# EAGLE design ds8 (EAGLE 6.1)
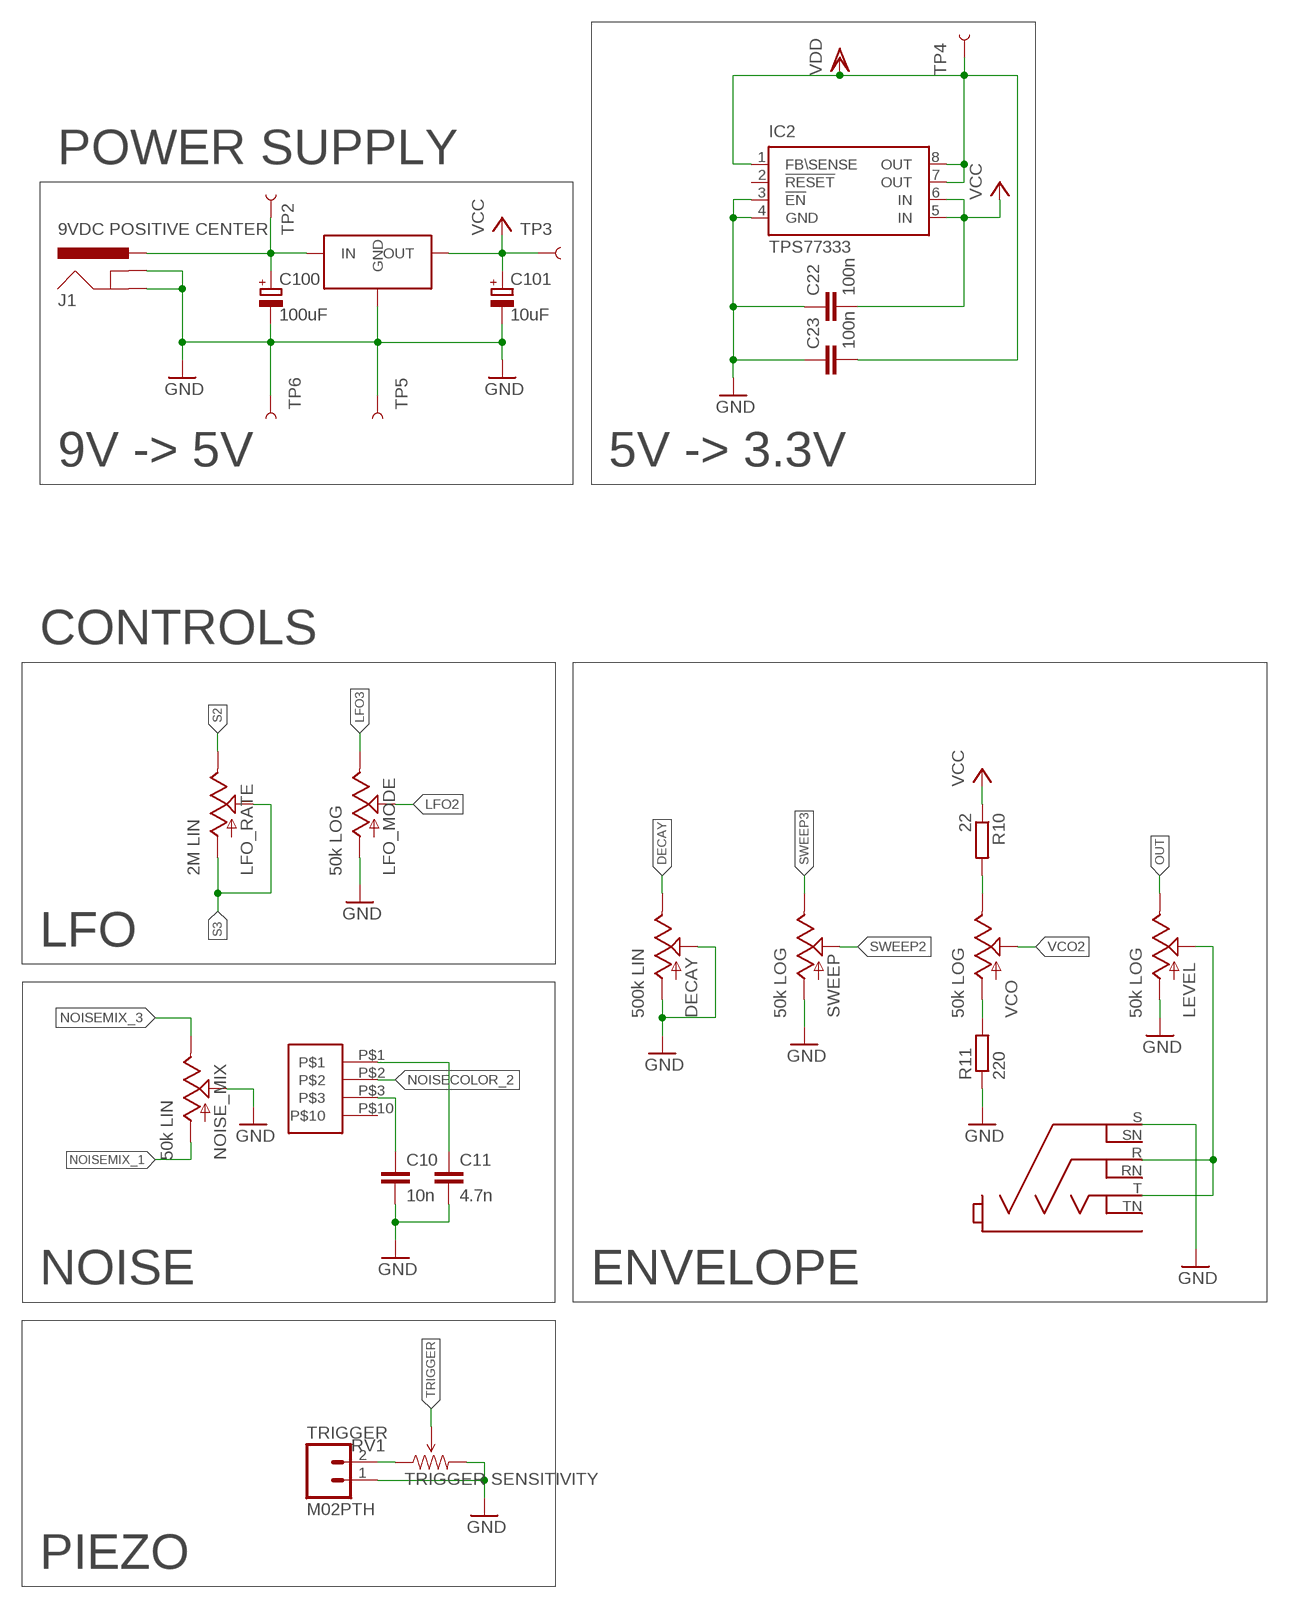
[diagram p0: schematic, sheet 1, part 1 of 2]
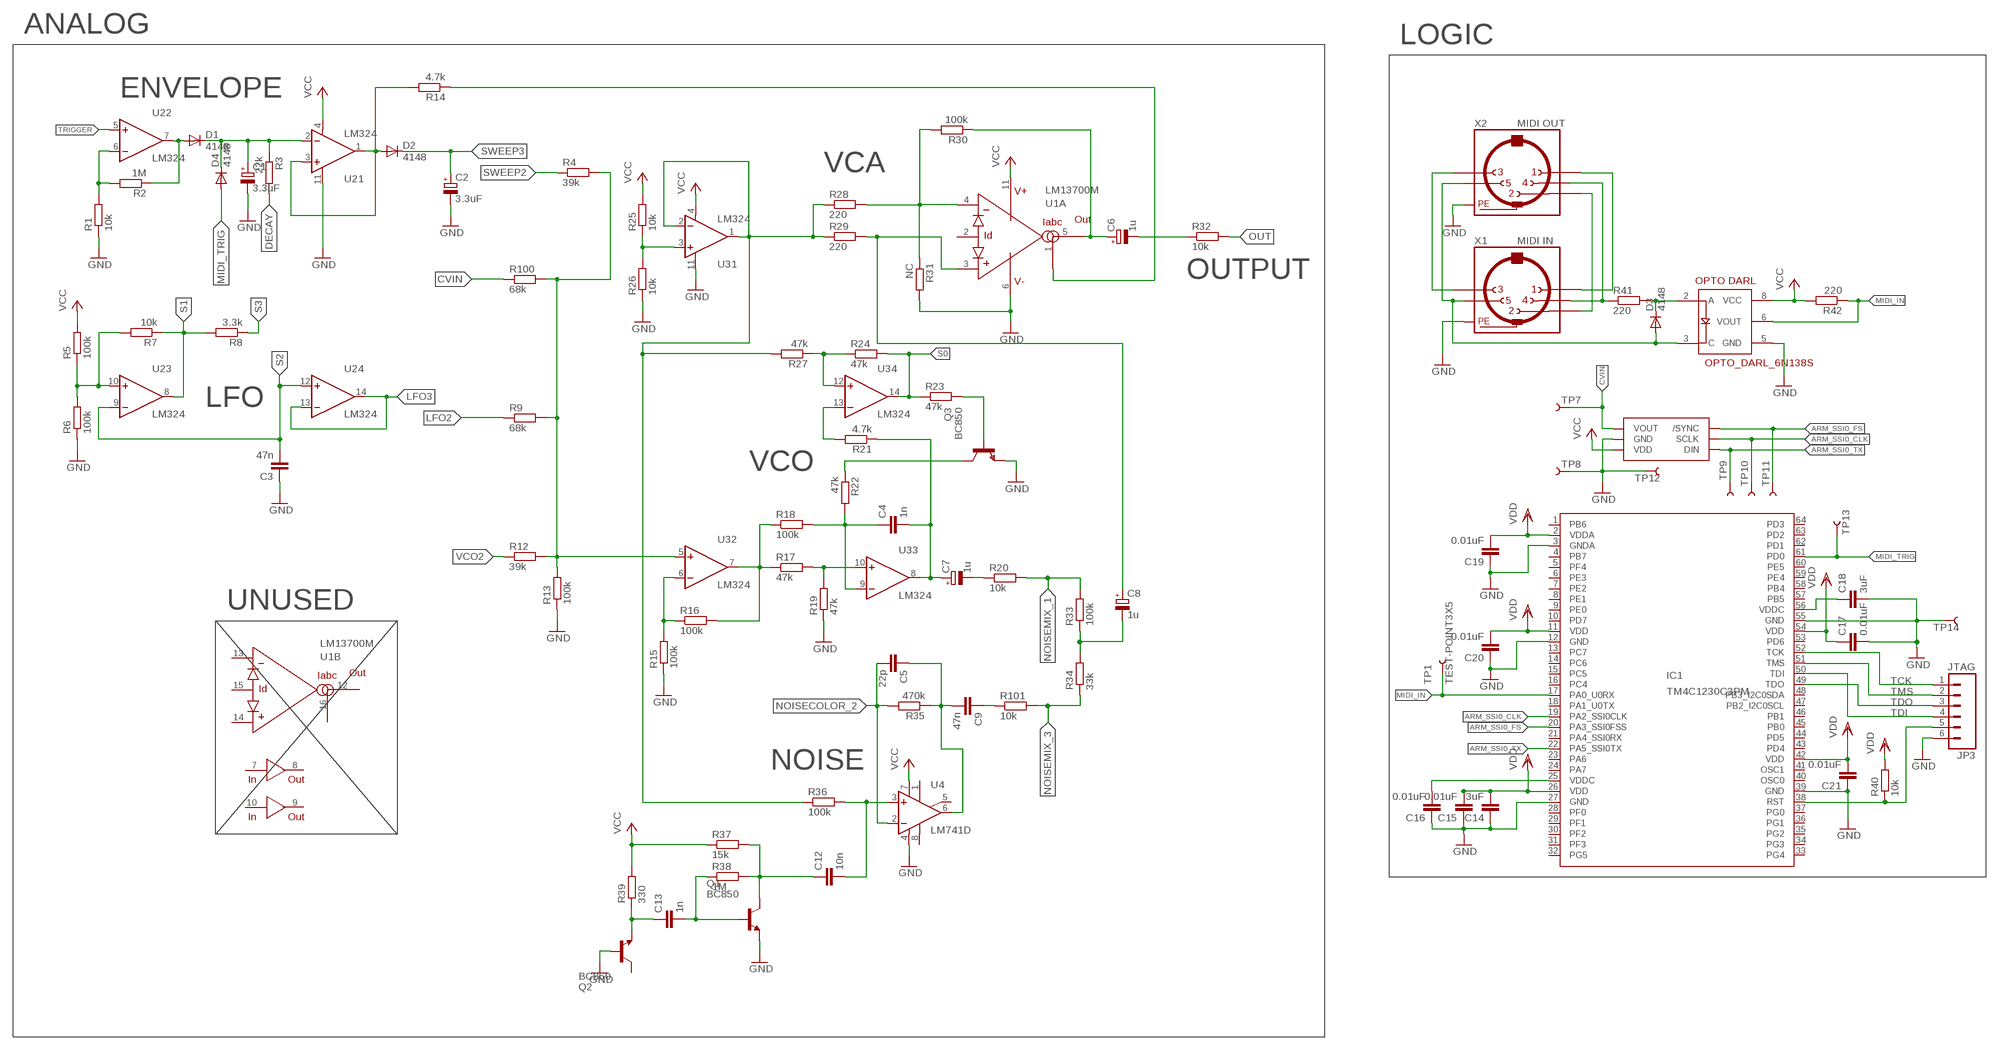
[diagram p1: schematic, sheet 1, part 2 of 2]

## Parts
C1  3.3uF  CPOL-EUR/2012-12R  [R/2012-12R]
C2  3.3uF  CPOL-EUR/2012-12R  [R/2012-12R]
C3  47n  C-EUC1206  [C1206]
C4  1n  C-EUC1206  [C1206]
C5  22p  C-EUC1206  [C1206]
C6  1u  CPOL-EUR/2012-12R  [R/2012-12R]
C7  1u  CPOL-EUR/2012-12R  [R/2012-12R]
C8  1u  CPOL-EUR/2012-12R  [R/2012-12R]
C9  47n  C-EUC1206  [C1206]
C10  10n  C-EUC1206  [C1206]
C11  4.7n  C-EUC1206  [C1206]
C12  10n  C-EUC1206  [C1206]
C13  1n  C-EUC1206  [C1206]
C14  3uF  C-EUC1206  [C1206]
C15  0.01uF  C-EUC1206  [C1206]
C16  0.01uF  C-EUC1206  [C1206]
C17  0.01uF  C-EUC1206  [C1206]
C18  3uF  C-EUC1206  [C1206]
C19  0.01uF  C-EUC1206  [C1206]
C20  0.01uF  C-EUC1206  [C1206]
C21  0.01uF  C-EUC1206  [C1206]
C22  100n  C-EUC1206  [C1206]
C23  100n  C-EUC1206  [C1206]
C100  100uF  CPOL-EUD  [PANASONIC_D]
C101  10uF  CPOL-EUR/2012-12R  [R/2012-12R]
D1  4148  DIODE-MINIMELF  [MINIMELF]
D2  4148  DIODE-MINIMELF  [MINIMELF]
D3  4148  DIODE-MINIMELF  [MINIMELF]
D4  4148  DIODE-MINIMELF  [MINIMELF]
DECAY  500k LIN  POTALPS-KIT  [ALPS_POT_KIT]
IC1  TM4C1230C3PM  [LQFP_64]
IC2  TPS77333  [SOP-08]
IC3  DAC7512  [SOT-23-6]
J1  9VDC POSITIVE CENTER  POWER_JACKPTH_LOCK  [POWER_JACK_PTH_LOCK]
JP3  JTAG  M06SIP  [1X06]
LEVEL  50k LOG  POTALPS-KIT  [ALPS_POT_KIT]
LFO_MODE  50k LOG  POTALPS-KIT  [ALPS_POT_KIT]
LFO_RATE  2M LIN  POTALPS-KIT  [ALPS_POT_KIT]
NOISE_MIX  50k LIN  POTALPS-KIT  [ALPS_POT_KIT]
Q1  BC850  [SOT23]
Q2  BC850  [SOT23]
Q3  BC850  [SOT23]
R1  10k  R-EU_R0805  [R0805]
R2  1M  R-EU_R0805  [R0805]
R3  22k  R-EU_R0805  [R0805]
R4  39k  R-EU_R0805  [R0805]
R5  100k  R-EU_R0805  [R0805]
R6  100k  R-EU_R0805  [R0805]
R7  10k  R-EU_R0805  [R0805]
R8  3.3k  R-EU_R0805  [R0805]
R9  68k  R-EU_R0805  [R0805]
R10  22  R-EU_R0805  [R0805]
R11  220  R-EU_R0805  [R0805]
R12  39k  R-EU_R0805  [R0805]
R13  100k  R-EU_R0805  [R0805]
R14  4.7k  R-EU_R0805  [R0805]
R15  100k  R-EU_R0805  [R0805]
R16  100k  R-EU_M0805  [M0805]
R17  47k  R-EU_M0805  [M0805]
R18  100k  R-EU_M0805  [M0805]
R19  47k  R-EU_M0805  [M0805]
R20  10k  R-EU_M0805  [M0805]
R21  4.7k  R-EU_M0805  [M0805]
R22  47k  R-EU_M0805  [M0805]
R23  47k  R-EU_M0805  [M0805]
R24  47k  R-EU_M0805  [M0805]
R25  10k  R-EU_M0805  [M0805]
R26  10k  R-EU_M0805  [M0805]
R27  47k  R-EU_M0805  [M0805]
R28  220  R-EU_M0805  [M0805]
R29  220  R-EU_M0805  [M0805]
R30  100k  R-EU_M0805  [M0805]
R31  NC  R-EU_M0805  [M0805]
R32  10k  R-EU_M0805  [M0805]
R33  100k  R-EU_M0805  [M0805]
R34  33k  R-EU_M0805  [M0805]
R35  470k  R-EU_M0805  [M0805]
R36  100k  R-EU_M0805  [M0805]
R37  15k  R-EU_M0805  [M0805]
R38  1M  R-EU_M0805  [M0805]
R39  330  R-EU_M0805  [M0805]
R40  10k  R-EU_M0805  [M0805]
R41  220  R-EU_R0805  [R0805]
R42  220  R-EU_R0805  [R0805]
R100  68k  R-EU_R0805  [R0805]
R101  10k  R-EU_M0805  [M0805]
RV1  TRIGGER SENSITIVITY  TRIMPOT  [TRIMPOT-5MM-V2]
SWEEP  50k LOG  POTALPS-KIT  [ALPS_POT_KIT]
TP1  TEST-POINT3X5  [PAD.03X.05]
TP2  TEST-POINT3X5  [PAD.03X.05]
TP3  TEST-POINT3X5  [PAD.03X.05]
TP4  TEST-POINT3X5  [PAD.03X.05]
TP5  TEST-POINT3X5  [PAD.03X.05]
TP6  TEST-POINT3X5  [PAD.03X.05]
TP7  TEST-POINT3X5  [PAD.03X.05]
TP8  TEST-POINT3X5  [PAD.03X.05]
TP9  TEST-POINT3X5  [PAD.03X.05]
TP10  TEST-POINT3X5  [PAD.03X.05]
TP11  TEST-POINT3X5  [PAD.03X.05]
TP12  TEST-POINT3X5  [PAD.03X.05]
TP13  TEST-POINT3X5  [PAD.03X.05]
TP14  TEST-POINT3X5  [PAD.03X.05]
TRIGGER  M02PTH  [1X02]
U1  LM13700M  DS8_LM13700M  [DS8_SO16]
U2  LM324  [SOIC-14]
U3  LM324  [SOIC-14]
U4  LM741D  [SO08]
U100  VREG-7805-DPAK2  [VREG-7805-DPAK2]
U$1  6.35MMJACK  [NMJ6HCD3]
U$3  ALPS_SRBV  [ALPS_SRBV]
U$4  OPTO_DARL_6N138S  [8-SMD]
VCO  50k LOG  POTALPS-KIT  [ALPS_POT_KIT]
X1  MIDI IN  MAB5SH  [MAB5SH]
X2  MIDI OUT  MAB5SH  [MAB5SH]

## Nets
9VDC: C100.+ J1.PWR TP2.P$1 U100.VIN(IN)
ARM_SSI0_CLK: IC1.19(PA2_SSI0CLK) IC3.5(SCLK) TP10.P$1
ARM_SSI0_FS: IC1.20(PA3_SSI0FSS) IC3.6(/SYNC) TP11.P$1
ARM_SSI0_TX: IC1.22(PA5_SSI0TX) IC3.4(DIN) TP9.P$1
CVIN: IC3.1(VOUT) R100.1 TP7.P$1
DECAY: DECAY.P$1(E) R3.2
GND: C1.- C2.- C3.1 C10.2 C11.2 C14.1 C15.1 C16.1 C17.2 C18.2 C19.1 C20.1 C21.1 C22.1 C23.1 C100.- C101.- DECAY.P$2(S) DECAY.P$3(A) IC1.3(GNDA) IC1.12(GND) IC1.27(GND) IC1.39(GND) IC1.55(GND) IC2.3(!EN) IC2.4(GND) IC3.2(GND) J1.GND J1.GNDBREAK JP3.6 LEVEL.P$3(A) LFO_MODE.P$3(A) NOISE_MIX.P$2(S) Q1.2(E) Q2.1(B) Q3.2(E) R1.1 R6.1 R11.1 R13.1 R15.1 R19.1 R26.1 R31.2 RV1.C(CW) SWEEP.P$3(A) TP5.P$1 TP6.P$1 TP8.P$1 TP12.P$1 TP14.P$1 TRIGGER.1 U1.6(V-) U2.11(1:V-) U3.11(1:V-) U4.4(V-) U100.GND U$1.S U$4.5(GND) X1.PE X1.PE@(PE) X2.PE X2.PE@(PE)
LFO2: LFO_MODE.P$2(S) R9.1
LFO3: LFO_MODE.P$1(E) U2.13(4:-IN) U2.14(4:OUT)
MIDI_IN: IC1.17(PA0_U0RX) R42.1 TP1.P$1 U$4.6(VOUT)
MIDI_TRIG: D4.A IC1.61(PD0) TP13.P$1
N$1: D1.A R2.1 U2.7(2:OUT)
N$2: R1.2 R2.2 U2.6(2:-IN)
N$3: C1.+ D1.C D4.C R3.1 U2.2(1:-IN)
N$4: D2.A R14.2 U2.1(1:OUT) U2.3(1:+IN)
N$5: R5.1 R6.2 R7.2 U2.10(3:+IN)
N$6: X1.1 X2.1
N$7: R15.2 R16.1 U3.6(2:-IN)
N$8: R4.2 R9.2 R12.2 R13.2 R100.2 U3.5(2:+IN)
N$9: R16.2 R17.1 R18.1 U3.7(2:OUT)
N$10: R17.2 R19.2 U3.10(3:+IN)
N$11: C4.1 R18.2 R22.2 U3.9(3:-IN)
N$12: C8.- R33.1 R34.2
N$13: C7.- R20.1
N$14: C4.2 C7.+ R21.1 U3.8(3:OUT)
N$15: Q3.3(C) R22.1
N$16: R21.2 U3.13(4:-IN)
N$17: R24.1 R27.1 U3.12(4:+IN)
N$18: R41.1 X1.4 X2.4
N$19: Q3.1(B) R23.2
N$20: R27.2 R28.1 R29.1 R36.1 U3.1(1:OUT) U3.2(1:-IN)
N$21: C9.1 R101.1
N$22: R25.1 R26.2 U3.3(1:+IN)
N$23: R28.2 R30.2 R31.1 U1.4(A:-IN)
N$24: C8.+ R29.2 U1.3(A:+IN)
N$25: C6.- R32.1
N$26: D3.C R41.2 U$4.2(A)
N$27: C6.+ R30.1 U1.5(A:OUT)
N$28: C5.1 C9.2 R35.1 U4.6(OUT)
N$29: C12.1 Q1.3(C) R37.2 R38.2
N$30: C12.2 R36.2 U4.3(+IN)
N$31: R14.1 U1.1(A:IABC)
N$32: C13.2 Q1.1(B) R38.1
N$33: C13.1 Q2.2(E) R39.1
N$34: RV1.A(CCW) TRIGGER.2
N$35: D3.A U$4.3(C) X1.5 X2.5
N$36: C18.1 IC1.56(VDDC)
N$37: R10.2 VCO.P$1(E)
N$38: R11.2 VCO.P$3(A)
N$39: C10.1 U$3.P$3
N$40: C11.1 U$3.P$1
N$41: X1.2 X2.2
N$42: C16.2 IC1.25(VDDC)
N$43: X1.3 X2.3
N$57: LEVEL.P$2(S) U$1.R U$1.T
NOISECOLOR_2: C5.2 R35.2 U4.2(-IN) U$3.P$2
NOISEMIX_1: NOISE_MIX.P$3(A) R20.2 R33.2
NOISEMIX_3: NOISE_MIX.P$1(E) R34.1 R101.2
OUT: LEVEL.P$1(E) R32.2
RST: IC1.38(RST) JP3.5 R40.1
S0: R23.1 R24.2 U3.14(4:OUT)
S1: R7.1 R8.2 U2.8(3:OUT)
S2: C3.2 LFO_RATE.P$1(E) U2.9(3:-IN) U2.12(4:+IN)
S3: LFO_RATE.P$2(S) LFO_RATE.P$3(A) R8.1
SWEEP2: R4.1 SWEEP.P$2(S)
SWEEP3: C2.+ D2.C SWEEP.P$1(E)
TCK: IC1.52(TCK) JP3.1
TDI: IC1.50(TDI) JP3.4
TDO: IC1.49(TDO) JP3.3
TMS: IC1.51(TMS) JP3.2
TRIGGER: RV1.B(WIPER) U2.5(2:+IN)
VCC: C22.2 C101.+ IC2.5(IN) IC2.6(IN) IC3.3(VDD) R5.2 R10.1 R25.2 R37.1 R39.2 R42.2 TP3.P$1 U1.11(V+) U2.4(1:V+) U3.4(1:V+) U4.7(V+) U100.VOUT(OUT) U$4.8(VCC)
VCO2: R12.1 VCO.P$2(S)
VDD: C14.2 C15.2 C17.1 C19.2 C20.2 C21.2 C23.2 IC1.2(VDDA) IC1.11(VDD) IC1.26(VDD) IC1.42(VDD) IC1.54(VDD) IC2.1(FB\SENSE) IC2.7(OUT) IC2.8(OUT) R40.2 TP4.P$1
Unconnected: IC1.1(PB6) IC1.4(PB7) IC1.5(PF4) IC1.6(PE3) IC1.7(PE2) IC1.8(PE1) IC1.9(PE0) IC1.10(PD7) IC1.13(PC7) IC1.14(PC6) IC1.15(PC5) IC1.16(PC4) IC1.18(PA1_U0TX) IC1.21(PA4_SSI0RX) IC1.23(PA6) IC1.24(PA7) IC1.28(PF0) IC1.29(PF1) IC1.30(PF2) IC1.31(PF3) IC1.32(PG5) IC1.33(PG4) IC1.34(PG3) IC1.35(PG2) IC1.36(PG1) IC1.37(PG0) IC1.40(OSC0) IC1.41(OSC1) IC1.43(PD4) IC1.44(PD5) IC1.45(PB0) IC1.46(PB1) IC1.47(PB2_I2C0SCL) IC1.48(PB3_I2C0SDA) IC1.53(PD6) IC1.57(PB5) IC1.58(PB4) IC1.59(PE4) IC1.60(PE5) IC1.62(PD1) IC1.63(PD2) IC1.64(PD3) IC2.2(!RESET) Q2.3(C) U1.2(A:ID) U1.7(IN) U1.8(OUT) U1.9(OUT) U1.10(IN) U1.12(B:OUT) U1.13(B:-IN) U1.14(B:+IN) U1.15(B:ID) U1.16(B:IABC) U4.1(ON1) U4.5(ON2) U4.8(OPT) U$1.RN U$1.SN U$1.TN U$3.P$10

## Notes on the sheet
- ANALOG
- LOGIC
- ENVELOPE
- POWER SUPPLY
- VCA
- OUTPUT
- 9V -> 5V | 5V -> 3.3V
- LFO
- CONTROLS
- VCO
- UNUSED
- LFO
- NOISE
- NOISE | ENVELOPE
- PIEZO

## Library data of the parts
C1 C2 C6-C8 C100 C101 = rcl:CPOL-EU: POLARIZED CAPACITOR, European symbol
C3-C5 C9-C23 = rcl:C-EU: CAPACITOR, European symbol
D1-D4 = diode:DIODE-: DIODE
DECAY LEVEL LFO_MODE LFO_RATE NOISE_MIX SWEEP VCO = SparkFun-Electromechanical:POT
IC1 = TM4:TM4C1230C3PM: tm4c1230c3pm_ra0_lqfp_v0p1 edit this description Auto generated by make-symbol-device-package-bsdl.ulp Rev. 43 Source: tm4c1230c3pm_ra0_lqfp_v0p1.bsdl
IC2 = texas:TPS773*: 250-mA LDO REGULATORS WITH RESET OUTPUT WITH 8-PIN MSOP PACKAGING Source: http://focus.ti.com/lit/ds/symlink/tps77333.pdf; MF: TEXAS INSTRUMENTS; MPN: TPS77333DGK; OC_FARNELL: 1510195; OC_NEWARK: 02M1919
IC3 = ds8:DAC7512
J1 = SparkFun-Connectors:POWER_JACK: Power Jack This is the standard 5.5mm barrel jack for power. The PTH is the most common, proven, reliable, footprint. The Slot footprint only works if the mill layer is transmitted to the PCB fab house so be warned. Mating wall wart : TOL-00298 (and others); PROD_ID: PRT-00119
JP3 = SparkFun-Connectors:M06: Header 6 Standard 6-pin 0.1" header. Use with straight break away headers (SKU : PRT-00116), right angle break away headers (PRT-00553), swiss pins (PRT-00743), machine pins (PRT-00117), and female headers (PRT-00115). Molex polarized connector foot print use with SKU : PRT-08094 with associated crimp pins and housings. NOTES ON THE VARIANTS LOCK and LOCK_LONGPADS... This footprint was designed to help hold the alignment of a through-hole component (i.e. 6-pin header) while soldering it into place. You may notice that each hole has been shifted either up or down by 0.005 of an inch from it's more standard position (which is a perfectly straight line). This slight alteration caused the pins (the squares in the middle) to touch the edges of the holes. Because they are alternating, it causes a "brace" to hold the component in place. 0.005 has proven to be the perfect amount of "off-center" position when using our standard breakaway headers. Although looks a little odd when you look at the bare footprint, once you have a header in there, the alteration is very hard to notice. Also,if you push a header all the way into place, it is covered up entirely on the bottom side. This idea of altering the position of holes to aid alignment will be further integrated into the Sparkfun Library for other footprints. It can help hold any component with 3 or more connection pins.
Q1-Q3 = transistor:BC850: NPN TRANSISTOR
R1-R42 R100 R101 = rcl:R-EU_: RESISTOR, European symbol
RV1 = SparkFun-Electromechanical:TRIMPOT: Various small potentiometers for "set-and-forget" applications
TP1-TP14 = SparkFun-Passives:TEST-POINT: Bare copper test points for troubleshooting or ICT
TRIGGER = SparkFun-Connectors:M02: Standard 2-pin 0.1" header. Use with - straight break away headers ( PRT-00116) - right angle break away headers (PRT-00553) - swiss pins (PRT-00743) - machine pins (PRT-00117) - female headers (PRT-00115) Molex polarized connector foot print use with: PRT-08233 with associated crimp pins and housings. 2.54_SCREWTERM for use with PRT-10571. 3.5mm Screw Terminal footprints for PRT-08084 5mm Screw Terminal footprints for use with PRT-08433
U1 = ds8:DS8_LM13700: National Dual OTA with buffers.
U2 U3 = seanvoisen:LM324: LM324 Quad Op-amp
U4 = linear:*741: OP AMP
U100 = vreg-7805-dpak2:VREG-7805-DPAK2
U$1 = ds8:6.35MMJACK
U$3 = ds8:ALPS_SRBV
U$4 = SparkFun-DiscreteSemi:OPTO_DARL_6N138S: Optoisolator, darlington pair output
X1 X2 = con-hirschmann:MAB5SH: Female CONNECTOR 5 pins 90 deg. with shield, horizontal (DIN 41524); OC_FARNELL: 809883; OC_NEWARK: unknown

## Board
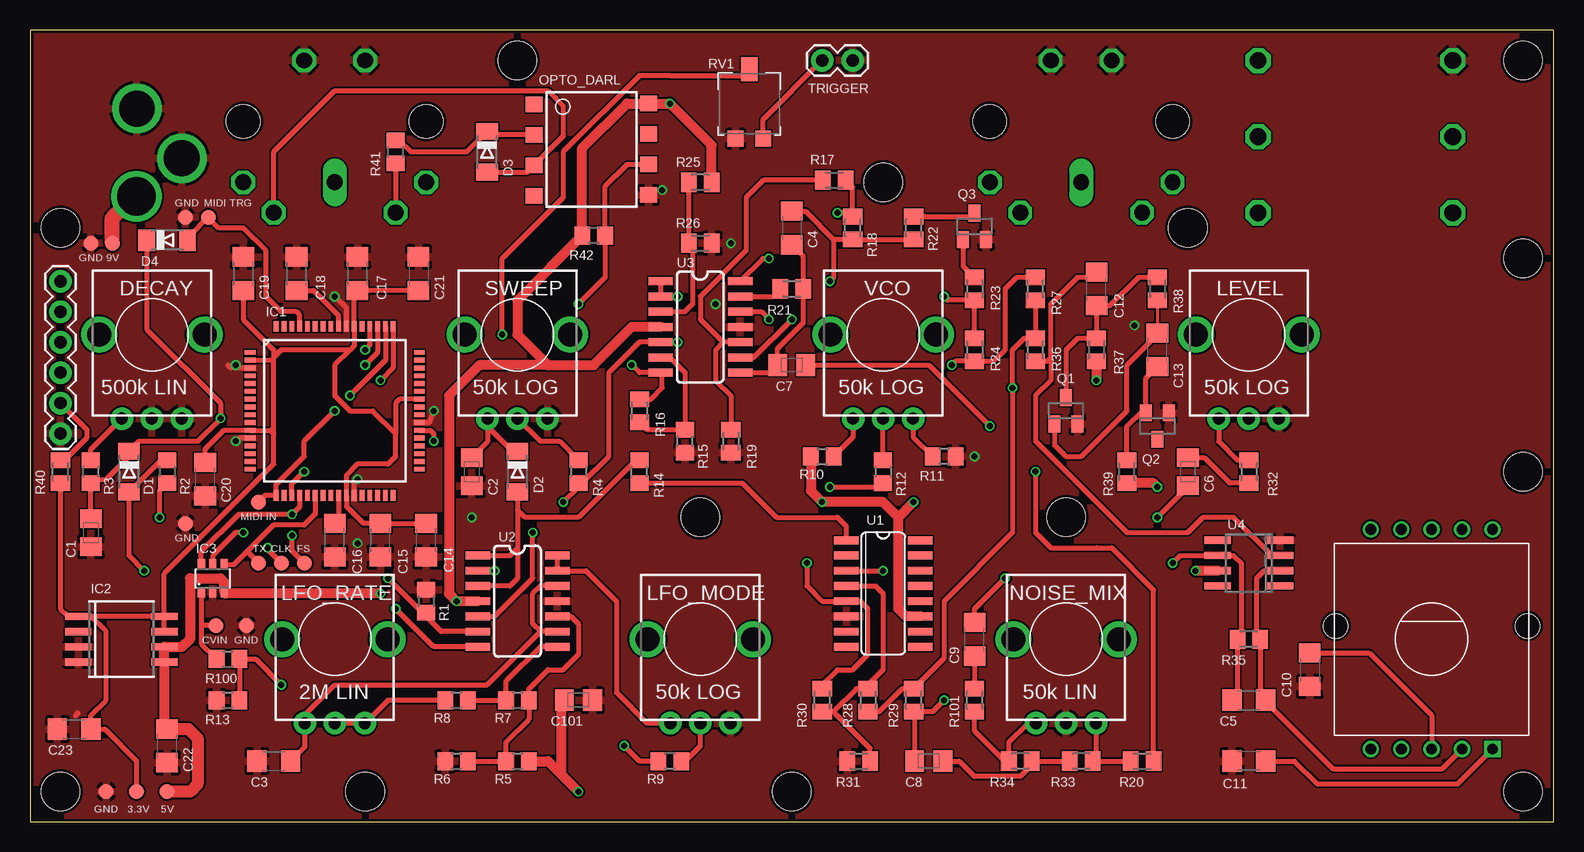
[diagram p2: board, top side]
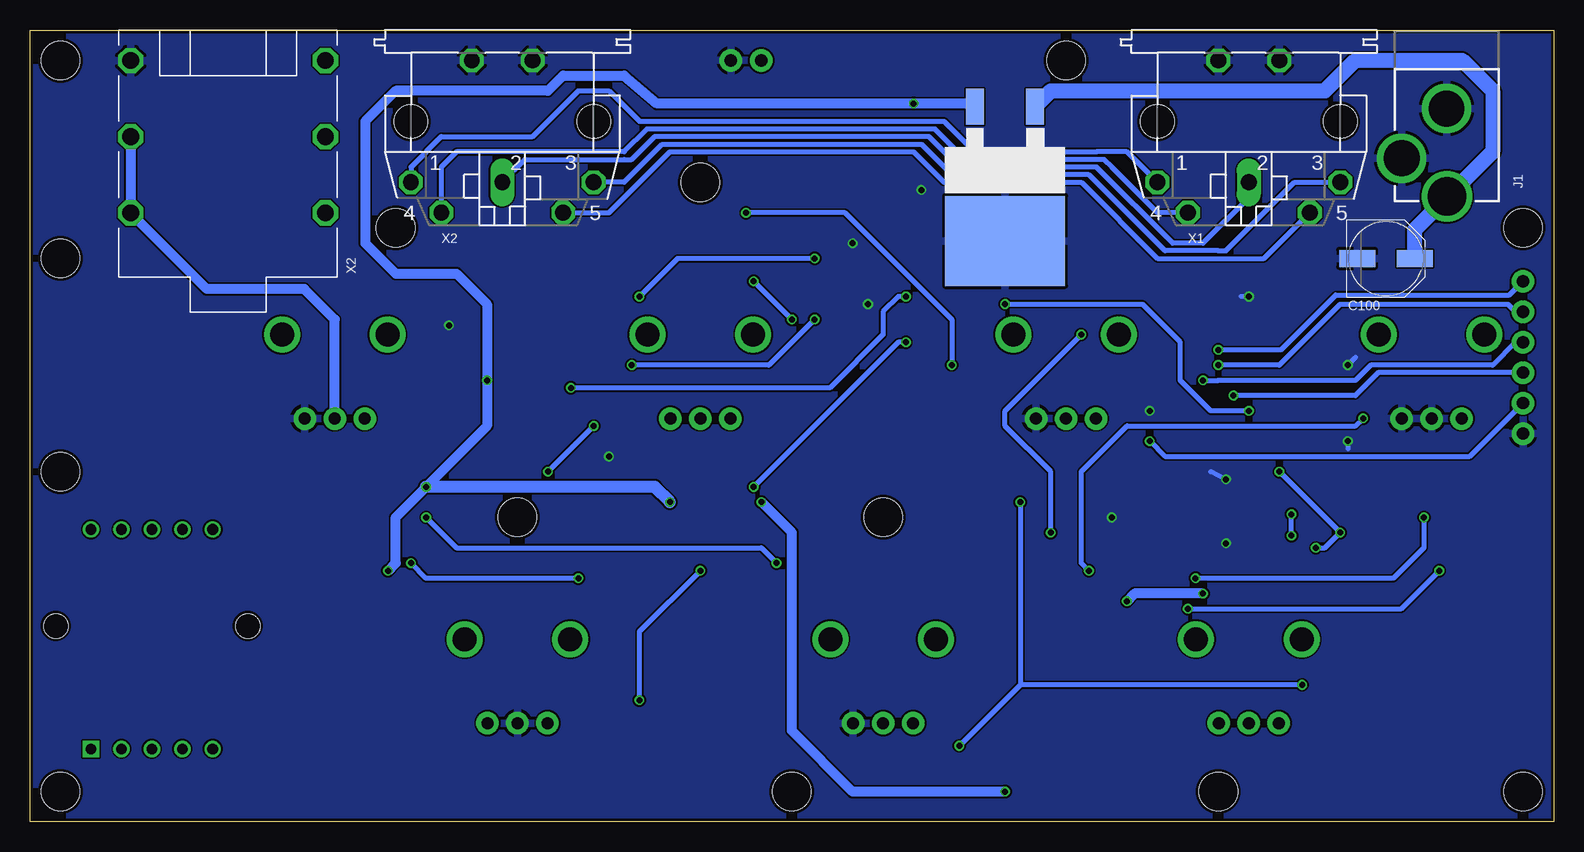
[diagram p3: board, bottom side, seen from below]

Size 127 x 66.04 mm. Coordinates in mm from the lower left corner, seen from the top.
Outline: 0,0 127,0 127,66.04 0,66.04 0,0
Copper layers (1*2*15*16): Top 0.035mm / dielectric 0.2mm / Route2 0.0175mm / dielectric 1.1mm / Route15 0.0175mm / dielectric 0.2mm / Bottom 0.035mm
Design rules: minimum track width 6mil, minimum drill 12mil, track to track 6mil, track to pad 6mil, pad to pad 6mil, via to via 6mil, smd to smd 0mil, copper to edge 10mil, drill to drill 10mil, minimum pad ring 6mil, minimum via ring 6mil, stop-mask expansion 2mil, vias tented up to drill 25mil, thermal gap 10mil
Holes 3.2 mm at 2.54,2.54 124.46,2.54 124.46,63.5 63.5,2.54 40.64,63.5 2.54,49.53 27.94,2.54 86.36,25.4 55.88,25.4 71.12,53.34 96.52,49.53 124.46,29.21 124.46,46.99

### Footprints (pad centres in the part's own frame; a part is rotated, then mirrored left to right if it is on the bottom)
R/2012-12R = smd 1.55 x 1.8: + 1.175,0; - -1.175,0
C1206 = smd 1.6 x 1.8: 1 -1.4,0; 2 1.4,0
PANASONIC_D = smd 3 x 1.4: + 2.4,0; - -2.4,0
MINIMELF = smd 1.4 x 1.8: A 1.7,0; C -1.7,0
ALPS_POT_KIT = drill 1 pad 1.88: P$1 7,-2.5; P$2 7,0; P$3 7,2.5 | drill 2: P$4 0,-4.4; P$5 0,4.4
LQFP_64 = smd 0.9 x 0.4: 1 -7.05,4.875; 2 -7.05,4.225; 3 -7.05,3.575; 4 -7.05,2.925; 5 -7.05,2.275; 6 -7.05,1.625; 7 -7.05,0.975; 8 -7.05,0.325; 9 -7.05,-0.325; 10 -7.05,-0.975; 11 -7.05,-1.625; 12 -7.05,-2.275; 13 -7.05,-2.925; 14 -7.05,-3.575; 15 -7.05,-4.225; 16 -7.05,-4.875; 33 7.05,-4.875; 34 7.05,-4.225; 35 7.05,-3.575; 36 7.05,-2.925; 37 7.05,-2.275; 38 7.05,-1.625; 39 7.05,-0.975; 40 7.05,-0.325; 41 7.05,0.325; 42 7.05,0.975; 43 7.05,1.625; 44 7.05,2.275; 45 7.05,2.925; 46 7.05,3.575; 47 7.05,4.225; 48 7.05,4.875 | smd 0.4 x 0.9: 17 -4.875,-7.05; 18 -4.225,-7.05; 19 -3.575,-7.05; 20 -2.925,-7.05; 21 -2.275,-7.05; 22 -1.625,-7.05; 23 -0.975,-7.05; 24 -0.325,-7.05; 25 0.325,-7.05; 26 0.975,-7.05; 27 1.625,-7.05; 28 2.275,-7.05; 29 2.925,-7.05; 30 3.575,-7.05; 31 4.225,-7.05; 32 4.875,-7.05; 49 4.875,7.05; 50 4.225,7.05; 51 3.575,7.05; 52 2.925,7.05; 53 2.275,7.05; 54 1.625,7.05; 55 0.975,7.05; 56 0.325,7.05; 57 -0.325,7.05; 58 -0.975,7.05; 59 -1.625,7.05; 60 -2.275,7.05; 61 -2.925,7.05; 62 -3.575,7.05; 63 -4.225,7.05; 64 -4.875,7.05
SOP-08 = smd 0.6 x 2.2: 1 -1.905,-3.6; 2 -0.635,-3.6; 3 0.635,-3.6; 4 1.905,-3.6; 5 1.905,3.575; 6 0.635,3.575; 7 -0.635,3.575; 8 -1.905,3.575
SOT-23-6 = smd 0.6 x 0.9: 1 -0.95,-1.15; 2 0,-1.15; 3 0.95,-1.15; 4 0.95,1.15; 5 0,1.15; 6 -0.95,1.15
POWER_JACK_PTH_LOCK = drill 2.997 pad 4.115: GND 0.025,6.557; GNDBREAK 3.762,10.7 | drill 3.2 pad 4.115: PWR 0,13.878
1X06 = drill 1.016 pad 1.88: 1 0,0; 2 2.54,0; 3 5.08,0; 4 7.62,0; 5 10.16,0; 6 12.7,0
SOT23 = smd 1 x 1.4: 1 -0.95,-1.1; 2 0.95,-1.1; 3 0,1.1
R0805 = smd 1.3 x 1.5: 1 -0.95,0; 2 0.95,0
M0805 = smd 1.3 x 1.6: 1 -0.95,0; 2 0.95,0
TRIMPOT-5MM-V2 = smd 1.3 x 1.3: A 1.15,-2.54; C -1.15,-2.54 | smd 1.402 x 2: B 0,3.239
PAD.03X.05 = smd 1.27 x 1.27: P$1 0,0
1X02 = drill 1.016 pad 1.88: 1 0,0; 2 2.54,0
DS8_SO16 = smd 0.66 x 2.032: 1 -4.445,-3.073; 2 -3.175,-3.073; 3 -1.905,-3.073; 4 -0.635,-3.073; 5 0.635,-3.073; 6 1.905,-3.073; 7 3.175,-3.073; 8 4.445,-3.073; 9 4.445,3.073; 10 3.175,3.073; 11 1.905,3.073; 12 0.635,3.073; 13 -0.635,3.073; 14 -1.905,3.073; 15 -3.175,3.073; 16 -4.445,3.073
SOIC-14 = smd 0.66 x 2.032: 1 -4.445,-3.315; 2 -3.175,-3.315; 3 -1.905,-3.315; 4 -0.635,-3.315; 5 0.635,-3.315; 6 1.905,-3.315; 7 3.175,-3.315; 8 3.175,3.315; 9 1.905,3.315; 10 0.635,3.315; 11 -0.635,3.315; 12 -1.905,3.315; 13 -3.175,3.315; 14 -4.445,3.315
SO08 = smd 0.6 x 2.2: 1 -1.905,-2.6; 2 -0.635,-2.6; 3 0.635,-2.6; 4 1.905,-2.6; 5 1.905,2.6; 6 0.635,2.6; 7 -0.635,2.6; 8 -1.905,2.6
VREG-7805-DPAK2 = smd 10 x 7.5: GND 0,8.7 | smd 1.5 x 3: VIN -2.5,-2.5; VOUT 2.5,-2.5
NMJ6HCD3 = drill 1.4 octagon: R -8.115,-8.9; RN 8.115,-8.9; S -8.115,-2.55; SN 8.115,-2.55; T -8.115,-15.25; TN 8.115,-15.25
ALPS_SRBV = drill 0.9 square: P$1 5.08,-9.15 | drill 0.9: P$2 2.54,-9.15; P$3 0,-9.15; P$4 -2.54,-9.15; P$5 -5.08,-9.15; P$6 -5.08,9.15; P$7 -2.54,9.15; P$8 0,9.15; P$9 2.54,9.15; P$10 5.08,9.15 | hole 2: 8,1.1; -8,1.1
8-SMD = smd 1.3 x 1.4: 1 -3.96,-4.96; 2 -1.42,-4.96; 3 1.12,-4.96; 4 3.66,-4.96; 5 3.59,4.58; 6 1.05,4.58; 7 -1.49,4.58; 8 -4.03,4.58
MAB5SH = drill 1.321 octagon: 1 7.62,5.08; 3 -7.62,5.08; 4 5.08,7.62; 5 -5.08,7.62; PE -2.54,-5.08; PE@ 2.54,-5.08 | drill 1.321 long: 2 0,5.08 | hole 2.794: 7.62,0; -7.62,0

### Placement (x,y rotation side)
C1  5.08,24.13 90 top
C2  36.83,29.21 90 top
C3  20.32,5.08 0 top
C4  63.5,49.53 270 top
C5  101.6,10.16 0 top
C6  96.52,29.21 270 top
C7  63.5,38.1 180 top
C8  74.93,5.08 180 top
C9  78.74,15.24 90 top
C10  106.68,12.7 270 top
C11  101.6,5.08 180 top
C12  88.9,44.45 90 top
C13  93.98,39.37 90 top
C14  33.02,23.5 90 top
C15  29.21,23.5 90 top
C16  25.4,23.5 90 top
C17  27.3,45.72 90 top
C18  22.23,45.72 90 top
C19  17.78,45.72 270 top
C20  14.61,28.57 90 top
C21  32.38,45.72 270 top
C22  11.43,6.35 90 top
C23  3.68,7.75 0 top
C100  13.97,46.99 0 bottom
C101  45.72,10.16 180 top
D1  8.26,29.21 270 top
D2  40.64,29.21 270 top
D3  38.1,55.88 270 top
D4  11.43,48.51 0 top
DECAY  10.16,40.64 270 top
IC1  25.4,34.29 0 top
IC2  7.62,15.24 270 top
IC3  15.24,20.32 0 top
J1  8.89,66.04 180 bottom
JP3  2.54,45.09 270 top
LEVEL  101.6,40.64 270 top
LFO_MODE  55.88,15.24 270 top
LFO_RATE  25.4,15.24 270 top
NOISE_MIX  86.36,15.24 270 top
Q1  86.36,34.29 0 top
Q2  93.98,33.02 180 top
Q3  78.74,49.66 0 top
R1  33.02,18.41 270 top
R2  11.43,29.21 270 top
R3  5.08,29.21 90 top
R4  45.72,29.21 270 top
R5  40.64,5.08 0 top
R6  35.56,5.08 0 top
R7  40.64,10.16 0 top
R8  35.56,10.16 0 top
R9  53.34,5.08 180 top
R10  66.04,30.48 0 top
R11  76.2,30.48 180 top
R12  71.12,29.21 270 top
R13  16.51,10.16 0 top
R14  50.8,29.21 90 top
R15  54.61,31.75 90 top
R16  50.8,34.29 90 top
R17  67.04,53.52 180 top
R18  68.58,49.53 270 top
R19  58.42,31.75 90 top
R20  92.71,5.08 180 top
R21  63.5,44.45 180 top
R22  73.66,49.53 270 top
R23  78.74,44.45 90 top
R24  78.74,39.37 90 top
R25  55.88,53.34 0 top
R26  55.88,48.26 180 top
R27  83.82,44.45 270 top
R28  69.85,10.16 90 top
R29  73.66,10.16 270 top
R30  66.04,10.16 270 top
R31  69.09,5.08 180 top
R32  101.6,29.21 90 top
R33  87.63,5.08 0 top
R34  82.55,5.08 0 top
R35  101.6,15.24 0 top
R36  83.82,39.37 270 top
R37  88.9,39.37 90 top
R38  93.98,44.45 90 top
R39  91.44,29.21 270 top
R40  2.54,29.21 270 top
R41  30.48,55.88 90 top
R42  46.99,48.9 180 top
R100  16.51,13.59 0 top
R101  78.74,10.16 270 top
RV1  59.96,59.52 0 top
SWEEP  40.64,40.64 270 top
TP1  19.05,26.67 0 top
TP2  6.86,48.26 0 top
TP3  11.43,2.54 0 top
TP4  8.89,2.54 0 top
TP5  6.35,2.54 0 top
TP6  5.08,48.26 0 top
TP7  15.49,16.38 0 top
TP8  18.03,16.38 0 top
TP9  19.05,21.59 0 top
TP10  20.95,21.59 0 top
TP11  22.86,21.59 0 top
TP12  12.95,24.89 0 top
TP13  14.86,50.42 0 top
TP14  12.95,50.42 0 top
TRIGGER  68.58,63.5 180 top
U1  71.12,19.05 270 top
U2  40.64,17.78 270 top
U3  55.88,40.64 270 top
U4  101.6,21.59 90 top
U100  45.72,57.15 180 bottom
U$1  110.49,66.04 0 bottom
U$3  116.84,15.24 0 top
U$4  46.99,55.88 270 top
VCO  71.12,40.64 270 top
X1  25.4,58.42 180 bottom
X2  87.63,58.42 180 bottom

### Tracks (layer width: path | path; a pad name or v marks a point on that pad's centre or on a via)
9VDC
  Top 1.27: 8.8,52.07 J1.PWR 6.86,50.38 TP2.P$1
  Bottom 0.406: 8.89,52.07 8.98,52.07
  Bottom 1.27: U100.VIN 41.91,60.96 19.05,60.96 16.51,63.5 7.62,63.5 5.08,60.96 5.08,55.88 8.89,52.07 | C100.+ 11.57,49.39 8.89,52.07 | 8.89,52.07 J1.PWR
ARM_SSI0_CLK  (via drill 0.5)
  Top 0.406: IC1.19 21.82,28.18 v22.86,29.21 | v17.78,24.13 17.14,24.13 15.24,22.23 IC3.5 | TP10.P$1 19.81,22.73 v19.81,22.86
  Bottom 0.406: v22.86,29.21 v17.78,24.13 19.05,22.86 v19.81,22.86
ARM_SSI0_FS  (via drill 0.5)
  Top 0.406: v21.84,25.65 17.4,25.65 14.29,22.55 IC3.6 | IC1.20 22.48,26.29 22.1,25.91 | 22.1,25.91 v21.84,25.65 | v21.84,25.65 22.1,25.91 | TP11.P$1 21.84,22.61 v21.84,23.88
  Bottom 0.406: v21.84,23.88 21.84,24 v21.84,25.65
ARM_SSI0_TX
  Top 0.406: IC1.22 23.77,25.68 22.86,24.77 20.32,24.77 18.1,22.54 | 18.1,22.54 17.02,21.47 IC3.4 | TP9.P$1 18.1,22.54
CVIN
  Top 0.406: IC3.1 14.29,17.78 14.29,16.38 | 14.29,16.38 14.29,14.86 R100.1 | TP7.P$1 14.29,16.38
DECAY
  Top 0.406: R3.2 5.08,31.06 DECAY.P$1
GND  (via drill 0.5)
  Top 0.406: 4.02,9.1 3.81,8.89 | 16.75,37.87 16.51,38.1 | IC1.12 17.41,32.02 v17.14,31.75 | IC1.39 33.31,33.31 v33.66,34.29 | IC1.55 26.38,42.84 v25.4,43.81 | IC1.27 27.02,28.3 v27.3,28.57 | IC1.3 17.38,37.87 v17.14,38.1
  Bottom 0.406: v17.14,31.75 17.14,31.11 | v25.4,43.81 26.04,43.81 | v27.3,28.57 28.57,29.21 | v17.14,38.1 16.51,38.73
  other vias: 36.83,25.4 52.7,52.7 58.42,48.26 57.15,43.18 92.08,41.4 78.74,30.48 27.3,23.24
  pour Top: -5.08,66.04 127,66.04 127,0 -5.08,0
  pour Bottom: -5.08,66.04 127,66.04 127,0 -5.08,0
LFO2
  Top 0.406: R9.1 54.61,5.08 55.88,6.35 LFO_MODE.P$2
LFO3
  Top 0.406: U2.14 U2.13 46.35,20.95 48.9,18.41 48.9,10.79 51.45,8.24 LFO_MODE.P$1
MIDI_IN  (via drill 0.5)
  Top 0.406: 47.94,53.02 R42.1 47.94,45.4 v45.72,43.18 | 47.94,53.02 49.75,54.83 | U$4.6 49.75,54.83 | v25.4,34.29 22.86,31.75 22.86,30.48 20.52,28.14 IC1.17 19.62,27.24 TP1.P$1 | 50.3,54.83 49.75,54.83 | 49.75,54.83 47.94,53.02
  Bottom 0.406: v45.72,43.18 34.29,43.18 31.11,40.01 31.11,36.83 28.57,34.29 v25.4,34.29
MIDI_TRIG
  Top 0.406: IC1.61 22.48,42.3 22.23,42.55 20.95,42.55 19.68,43.81 19.68,47.62 17.78,49.53 15.75,49.53 TP13.P$1 13.34,48.9 13.13,48.9 D4.A
N$1  (via drill 0.5)
  Top 0.406: U2.7 33.66,14.61 v30.48,17.78 | v9.53,20.95 8.26,22.23 D1.A 10.9,30.16 R2.1
  Bottom 0.406: v30.48,17.78 12.7,17.78 v9.53,20.95
N$2  (via drill 0.5)
  Top 0.406: U2.6 34.29,15.88 33.02,17.14 R1.2 33.02,17.78 32.38,17.78 v29.84,20.32 | v10.79,25.4 10.79,27.62 R2.2
  Bottom 0.406: v10.79,25.4 10.79,22.86 13.34,20.32 v29.84,20.32
N$3  (via drill 0.5)
  Top 0.406: C1.+ R3.1 5.39,28.57 6.35,28.57 8.26,30.48 D1.C 9.1,31.75 13.97,31.75 v15.88,33.66 15.88,34.92 9.73,41.07 D4.C | U2.2 v38.73,20.95
  Bottom 0.406: v38.73,20.95 39.37,21.59 39.37,29.21 35.56,33.02 16.51,33.02 v15.88,33.66
N$4
  Top 0.406: R14.2 50.48,30.16 45.72,25.4 41.27,25.4 40.64,26.04 | D2.A 40.64,26.04 | 40.64,26.04 40.64,22.86 | 40.64,22.86 40.64,20.32 40.01,19.68 U2.3 | U2.1 40.01,22.23 40.64,22.86
N$5
  Top 0.406: R6.2 R5.1 39.69,6.67 41.59,8.57 R7.2 41.59,11.11 43.18,12.7 44.45,12.7 45.72,13.97 45.72,16.51 45.09,17.14 U2.10
N$6
  Bottom 0.406: X1.1 35.56,55.88 38.1,55.88 40.64,55.88 48.26,55.88 50.8,58.42 52.07,58.42 76.2,58.42 78.74,60.96 81.28,60.96 82.55,59.69 85.09,57.15 92.71,57.15 95.25,54.61 X2.1
N$7
  Top 0.406: U3.6 53.34,38.73 54.61,37.47 R15.2 51.44,32.7 R16.1
N$8  (via drill 0.5)
  Top 0.406: R13.2 R100.2 18.8,13.59 v20.95,11.43 | v44.45,26.67 45.72,27.94 R4.2 46.04,28.26 48.26,30.48 48.26,37.47 50.8,40.01 U3.5 v53.98,40.01 | R9.2 50.8,5.08 v49.53,6.35 | 70.8,27.94 R12.2 71.12,27.94 v66.67,27.94
  Bottom 0.406: v44.45,26.67 44.45,11.43 | 44.45,11.43 v49.53,6.35 | v20.95,11.43 44.45,11.43 | v53.98,40.01 54.61,40.01 v66.67,27.94
N$9  (via drill 0.5)
  Top 0.406: R16.2 51.75,35.24 52.7,36.2 52.7,37.33 U3.7 50.8,37.47 v50.16,38.1 | R17.1 68.58,52.92 R18.1 68.26,50.8 v67.31,50.8
  Bottom 0.406: v50.16,38.1 50.16,41.91 59.05,50.8 v67.31,50.8
N$10
  Top 0.406: R17.2 61.13,53.52 59.69,52.07 59.69,47.62 55.88,43.81 55.88,41.91 57.78,40.01 | U3.10 57.78,40.01 | 57.78,40.01 57.15,39.37 57.15,36.83 58.42,35.56 R19.2
N$11  (via drill 0.5)
  Top 0.406: R22.2 R18.2 66.99,48.58 | C4.1 64.64,50.93 66.99,48.58 | U3.9 60.33,38.73 v63.5,41.91 | 66.99,48.58 66.99,45.4 v66.67,45.09
  Bottom 0.406: v63.5,41.91 v66.67,45.09
N$12
  Top 0.406: R33.1 R34.2 83.5,4.76 82.55,3.81 78.74,3.81 77.47,5.08 C8.-
N$13  (via drill 0.5)
  Top 0.406: R20.1 93.66,19.37 90.17,22.86 88.9,22.86 85.09,22.86 83.82,24.13 v83.82,29.21 | v80.01,33.02 74.93,38.1 C7.-
  Bottom 0.406: v83.82,29.21 v80.01,33.02
N$14
  Top 0.406: C4.2 64.45,47.18 R21.1 64.45,41.59 62.33,39.47 C7.+ 61.69,37.47 U3.8
N$15
  Top 0.406: R22.1 74.61,50.48 78.42,50.48 78.74,50.8
  Top 0.61: 78.74,50.8 Q3.3
N$16
  Top 0.406: U3.13 61.91,43.81 R21.2
N$17  (via drill 0.5)
  Top 0.406: R27.1 82.23,45.4 81.28,44.45 81.28,39.37 80.33,38.42 R24.1 77.16,38.42 v76.83,38.1 | U3.12 60.96,42.55 v61.59,41.91
  Bottom 0.406: v61.59,41.91 65.41,38.1 v76.83,38.1
N$18
  Top 0.406: R41.1 X1.4
  Bottom 0.406: X1.4 33.02,50.8 36.83,54.61 37.47,55.24 38.86,55.24 49.02,55.24 51.56,57.78 75.56,57.78 77.47,55.88 91.44,55.88 92.71,54.61 X2.4
N$19
  Top 0.406: Q3.1 77.79,46.35 R23.2
N$20  (via drill 0.5)
  Top 0.406: U3.1 U3.2 v53.98,43.81 | R27.2 R36.1 82.86,40.32 81.92,39.37 v81.92,36.2 81.92,24.13 76.2,18.41 76.2,13.65 R29.1 72.7,11.11 70.81,9.21 R28.1
  Bottom 0.406: v53.98,43.81 54.61,43.81 55.88,42.55 55.88,40.64 60.33,36.2 v81.92,36.2
N$21
  Top 0.406: C9.1 R101.1
N$22
  Top 0.406: R25.1 R26.2 55.24,47.95 55.24,43.18 54.61,42.55 U3.3
N$23
  Top 0.406: 69.85,5.4 R31.1 70.04,6.16 67,9.21 | R30.2 67,9.21 | 67,9.21 68.89,11.11 R28.2 69.85,11.43 71.12,12.7 71.12,19.05 70.48,19.68 U1.4
N$24  (via drill 0.5)
  Top 0.406: C8.+ 73.75,8.79 73.66,8.89 R29.2 75.25,9.21 v76.2,10.16 | U1.3 v71.12,20.95
  Bottom 0.406: v76.2,10.16 76.2,15.88 v71.12,20.95
N$25
  Top 0.406: C6.- 97.89,30.39 100.01,28.26 R32.1
N$26
  Top 0.406: R41.2 30.8,56.83 31.75,55.88 36.4,55.88 D3.C 38.38,57.3 U$4.2
N$27  (via drill 0.5)
  Top 0.406: R30.1 66.04,11.43 67.31,12.7 68.58,12.7 69.85,13.97 69.85,17.78 69.22,18.41 U1.5 | U1.5 67.94,18.41 | C6.+ 96.52,27.94 v93.98,25.4 | v64.77,21.59 64.77,19.68 66.04,18.41 U1.5
  Bottom 0.406: v93.98,25.4 93.34,24.77 91.44,22.86 66.04,22.86 v64.77,21.59
N$28  (via drill 0.5)
  Top 0.406: C5.1 100.65,10.61 R35.1 100.97,15.55 100.97,21.59 100.33,22.23 U4.6 95.89,22.23 v95.25,21.59 | C9.2 78.74,17.78 v81.28,20.32
  Bottom 0.406: v81.28,20.32 93.98,20.32 v95.25,21.59
N$29
  Top 0.406: R38.2 92.39,45.4 90.04,43.05 C12.1 R37.2 87.31,40.32 86.36,39.37 Q1.3
N$30
  Top 0.406: C12.2 88.9,45.72 88.58,45.4 87.31,45.4 85.09,43.18 85.09,38.73 | R36.2 84.78,38.42 85.09,38.73 | 85.09,38.73 85.09,36.83 83.82,35.56 83.82,31.75 91.44,24.13 96.52,24.13 97.79,25.4 100.33,25.4 103.5,22.23 U4.3
N$31
  Top 0.406: U1.1 68.05,24.66 67.31,25.4 62.23,25.4 59.37,28.26 R14.1
N$32
  Top 0.254: R38.1 C13.2
  Top 0.406: Q1.1 85.41,31.43 86.36,30.48 87.63,30.48 91.44,34.29 91.44,38.1 93.98,40.64 C13.2
N$33
  Top 0.406: R39.1 91.44,33.02 92.71,34.29 92.88,34.12 Q2.2 93.03,37.02 C13.1
N$34
  Top 0.406: RV1.A 61.11,58.57 TRIGGER.2
N$35
  Top 0.406: D3.A 41.45,54.18 U$4.3 44.45,57.18 44.45,59.69 43.18,60.96 25.4,60.96 20.32,55.88 X1.5
  Bottom 0.406: X2.5 78.74,50.8 73.66,55.88 53.34,55.88 50.8,53.34 39.37,53.34 33.02,46.99 24.13,46.99 X1.5
N$36
  Top 0.406: C18.1 23.62,44.32 25.73,42.22 IC1.56
N$37
  Top 0.406: VCO.P$1 68.62,32.11 R10.2
N$38
  Top 0.406: VCO.P$3 73.62,32.11 R11.2
N$39
  Top 0.406: C10.1 111.63,14.1 116.84,8.89 U$3.P$3
N$40
  Top 0.406: C11.1 105.41,5.08 107.31,3.17 119,3.17 U$3.P$1
N$41
  Bottom 0.406: X1.2 25.4,52.07 29.21,48.26 31.75,48.26 38.1,54.61 49.53,54.61 52.07,57.15 74.93,57.15 76.83,55.24 77.47,55.24 85.72,55.24 X2.2
N$42
  Top 0.406: IC1.25 25.73,25.22 C16.2
N$43
  Bottom 0.406: X1.3 21.59,53.34 27.3,47.62 27.94,47.62 32.38,47.62 38.73,53.98 50.16,53.98 52.7,56.52 74.3,56.52 77.47,53.34 X2.3
N$57
  Bottom 0.813: LEVEL.P$2 101.6,41.91 104.14,44.45 112.27,44.45 U$1.T U$1.R
NOISECOLOR_2
  Top 0.406: U$3.P$2 117.73,4.45 108.58,4.45 103,10.03 C5.2 102.55,10.61 R35.2 102.23,15.55 102.23,20.32 102.87,20.95 U4.2
NOISEMIX_1
  Top 0.406: NOISE_MIX.P$3 88.86,5.36 R33.2 R20.2
NOISEMIX_3
  Top 0.406: R101.2 78.74,7.62 81.28,5.08 R34.1 81.6,6.67 83.17,8.24 NOISE_MIX.P$1
OUT
  Top 0.406: LEVEL.P$1 99.1,31.71 100.65,30.16 R32.2
RST  (via drill 0.5)
  Top 0.406: IC1.38 33.38,32.66 33.66,32.38 v33.66,31.75 | R40.1 2.85,30.16 3.81,31.11 4.76,32.07 4.76,32.7 JP3.5
  Bottom 0.406: v33.66,31.75 32.38,30.48 6.99,30.48 JP3.5
S0  (via drill 0.5)
  Top 0.406: R24.2 R23.1 76.52,43.5 v76.2,43.81 | U3.14 61.1,46.99 v61.59,46.99
  Bottom 0.406: v61.59,46.99 73.03,46.99 v76.2,43.81
S1
  Top 0.406: R8.2 R7.1 39.69,11.75 42.55,14.61 U2.8
S2
  Top 0.406: C3.2 22.9,6.26 LFO_RATE.P$1 22.9,8.93 25.4,11.43 38.1,11.43 42.55,15.88 | U2.9 42.55,15.88 | 42.55,15.88 41.91,16.51 41.91,19.05 42.55,19.68 U2.12
S3
  Top 0.406: LFO_RATE.P$2 LFO_RATE.P$3 27.93,8.24 29.84,10.16 R8.1
SWEEP2
  Top 0.406: SWEEP.P$2 40.66,33.64 42.55,31.75 44.13,31.75 R4.1
SWEEP3
  Top 0.254: 38.14,32.97 38.16,32.97 | D2.C 40.21,30.91
  Top 0.406: SWEEP.P$1 38.14,32.97 38.14,31.7 C2.+ | 38.16,32.97 40.21,30.91
TCK  (via drill 0.5)
  Top 0.406: IC1.52 28.32,39.76 v27.94,39.37
  Bottom 0.406: v27.94,39.37 22.73,39.37 18.16,43.94 3.68,43.94 JP3.1
TDI  (via drill 0.5)
  Top 0.406: IC1.50 29.62,38.52 v26.67,35.56
  Bottom 0.406: JP3.4 14.61,37.47 16.51,35.56 v26.67,35.56
TDO  (via drill 0.5)
  Top 0.406: IC1.49 30.27,37.9 v29.21,36.83
  Bottom 0.406: JP3.3 3.17,40.01 5.08,38.1 15.24,38.1 16.51,36.83 27.94,36.83 v29.21,36.83
TMS  (via drill 0.5)
  Top 0.406: IC1.51 28.98,39.13 v27.94,38.1
  Bottom 0.406: JP3.2 3.17,42.55 3.81,43.18 17.78,43.18 22.86,38.1 v27.94,38.1
TRIGGER  (via drill 0.5)
  Top 0.406: U2.5 38.73,17.14 41.91,20.32 v41.91,24.13 | v39.37,40.64 39.37,46.99 44.45,52.07 44.45,55.88 50.8,62.23 53.34,62.23 59.69,62.23 59.96,62.5 RV1.B
  Bottom 0.406: v41.91,24.13 41.91,29.21 45.72,33.02 45.72,34.29 v39.37,40.64
VCC  (via drill 0.5)
  Top 0.813: 43.18,38.1 40.64,40.64 40.64,43.49 R42.2 46.04,56.2 49.75,59.91 v53.34,59.91 | 43.18,38.1 46.99,38.1 50.16,41.27 U3.4 | U1.11 73.03,17.14 72.39,17.78 72.39,25.4 | 72.39,25.4 71.12,26.67 v66.04,26.67 65.09,27.62 R10.1 | U4.7 v97.16,20.95 | v93.98,27.94 93.66,28.26 R39.2 | 72.39,25.4 v73.66,26.67 | R37.1 v88.9,36.83 | U2.4 v35.56,18.41 34.92,19.05 34.92,35.56 37.47,38.1 43.18,38.1 | v29.21,19.05 16.31,19.05 IC3.3 16.19,20 15.88,20.32 13.34,20.32 13.34,15.24 12.7,14.61 IC2.6 IC2.5 11.2,7.99 C22.2 | 44.32,3.94 v45.72,2.54 | U$4.8 v53.34,59.91 | R25.2 56.83,56.42 v53.34,59.91 | 44.32,3.94 44.32,9.94 C101.+ | R5.2 43.18,5.08 44.32,3.94
  Top 1.016: C22.2 13.21,7.75 13.97,6.99 13.97,3.17 13.34,2.54 TP3.P$1
  Bottom 0.813: v97.16,20.95 96.52,21.59 96.52,25.4 v93.98,27.94 88.9,33.02 v88.9,36.83 88.9,43.18 91.44,45.72 96.52,45.72 99.06,48.26 99.06,58.42 96.52,60.96 83.82,60.96 82.55,62.23 77.47,62.23 74.71,59.91 v53.34,59.91 48.48,59.91 U100.VOUT | v35.56,18.41 34.92,19.05 v29.21,19.05 | v45.72,2.54 58.42,2.54 63.5,7.62 63.5,24.13 v66.04,26.67
  Bottom 1.016: v73.66,26.67 74.93,27.94 v93.98,27.94
VCO2
  Top 0.406: R12.1 VCO.P$2
VDD
  Top 0.406: IC2.7 IC2.8 | IC2.8 5.08,17.14 | 5.08,17.14 IC2.1 3.17,17.14 2.54,17.78 R40.2 | 5.08,17.14 6.35,15.88 6.35,10.16 5.08,8.89 C23.2 6.22,7.75 8.89,5.08 TP4.P$1 | C19.2 17.78,41.91 20.32,39.37 20.32,38.73 | 20.32,32.38 20.32,29.84 11.2,20.72 IC2.8 | 20.32,32.38 20.32,38.73 | IC1.2 20.1,38.52 arc90 20.32,38.73 | 20.32,32.38 20.04,32.66 IC1.11 16.16,32.66 14.61,31.11 C20.2 | C21.2 28.07,44.32 27.94,44.45 27.81,44.32 C17.1 27.02,44.04 IC1.54 27.02,39.73 26.67,39.37 | C14.2 C15.2 27.81,24.89 26.38,26.33 IC1.26 26.38,28.91 27.3,29.84 29.84,29.84 30.48,30.48 30.48,32.38 | 26.67,39.37 20.95,39.37 20.32,38.73 | IC1.42 30.82,35.27 30.48,34.92 30.48,32.38 | 26.67,39.37 25.4,38.1 25.4,35.56 26.67,34.29 28.57,34.29 30.48,32.38

### Text on the board
tNames: OPTO_DARL | GND | MIDI TRG | GND | 9V | MIDI IN | GND | TX | CLK | FS | CVIN | GND | GND | 3.3V | 5V
bNames: X2
tValues: 6N138S | LM324 | LM324
bValues: L7805 | AUDIO OUT | U100